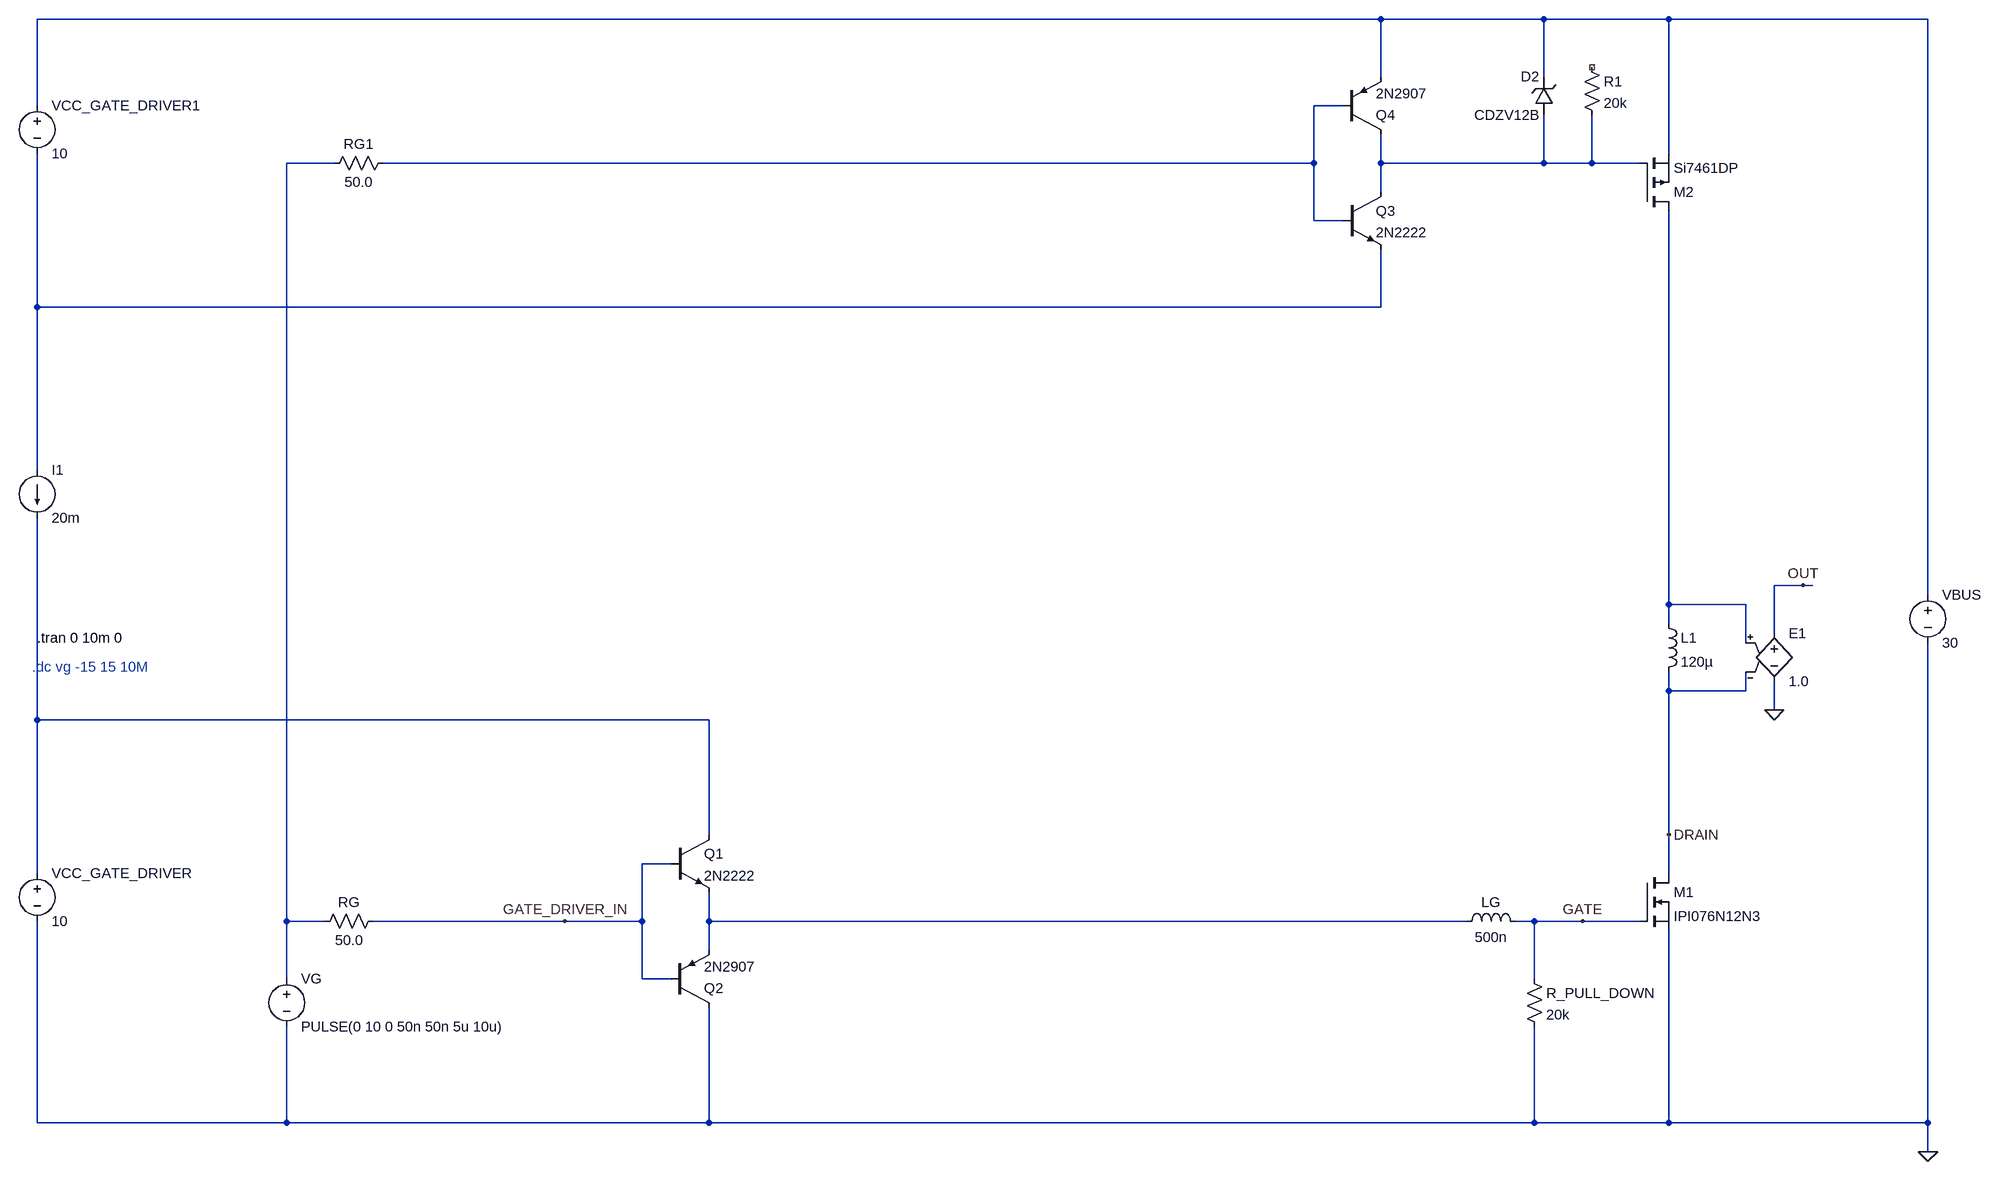
[diagram p0: schematic Hi_Lo_Gate_Driver.asc]
Hi_Lo_Gate_Driver.asc, the LTspice schematic file:
Version 4.1
SHEET 1 2380 948
WIRE 1376 -1248 -864 -1248
WIRE 1648 -1248 1376 -1248
WIRE 1856 -1248 1648 -1248
WIRE 2288 -1248 1856 -1248
WIRE 1376 -1152 1376 -1248
WIRE 1648 -1152 1648 -1248
WIRE -864 -1104 -864 -1248
WIRE 1312 -1104 1264 -1104
WIRE 1856 -1024 1856 -1248
WIRE -368 -1008 -448 -1008
WIRE 1264 -1008 1264 -1104
WIRE 1264 -1008 -288 -1008
WIRE 1376 -1008 1376 -1056
WIRE 1648 -1008 1648 -1088
WIRE 1648 -1008 1376 -1008
WIRE 1728 -1008 1728 -1088
WIRE 1728 -1008 1648 -1008
WIRE 1808 -1008 1728 -1008
WIRE 1376 -960 1376 -1008
WIRE 1264 -912 1264 -1008
WIRE 1312 -912 1264 -912
WIRE -864 -768 -864 -1024
WIRE 1376 -768 1376 -864
WIRE 1376 -768 -864 -768
WIRE -864 -496 -864 -768
WIRE 2080 -304 2032 -304
WIRE 2096 -304 2080 -304
WIRE 2288 -288 2288 -1248
WIRE 1856 -272 1856 -928
WIRE 1984 -272 1856 -272
WIRE 1856 -240 1856 -272
WIRE 2032 -224 2032 -304
WIRE 1984 -208 1984 -272
WIRE 1856 -128 1856 -160
WIRE 1984 -128 1984 -160
WIRE 1984 -128 1856 -128
WIRE 2032 -96 2032 -144
WIRE -864 -80 -864 -416
WIRE 256 -80 -864 -80
WIRE 256 112 256 -80
WIRE 1856 112 1856 -128
WIRE 192 160 144 160
WIRE -864 176 -864 -80
WIRE 1856 176 1856 112
WIRE -448 256 -448 -1008
WIRE -384 256 -448 256
WIRE 16 256 -304 256
WIRE 144 256 144 160
WIRE 144 256 16 256
WIRE 256 256 256 208
WIRE 1520 256 256 256
WIRE 1632 256 1600 256
WIRE 1712 256 1632 256
WIRE 1808 256 1712 256
WIRE 256 304 256 256
WIRE -448 352 -448 256
WIRE 144 352 144 256
WIRE 192 352 144 352
WIRE 1632 352 1632 256
WIRE -864 592 -864 256
WIRE -448 592 -448 432
WIRE -448 592 -864 592
WIRE 256 592 256 400
WIRE 256 592 -448 592
WIRE 1632 592 1632 432
WIRE 1632 592 256 592
WIRE 1856 592 1856 272
WIRE 1856 592 1632 592
WIRE 2288 592 2288 -208
WIRE 2288 592 1856 592
WIRE 2288 640 2288 592
FLAG 2288 640 0
FLAG 1712 256 GATE
FLAG 1856 112 DRAIN
FLAG 16 256 GATE_DRIVER_IN
FLAG 2032 -96 0
FLAG 2080 -304 OUT
SYMBOL npn 192 112 R0
SYMATTR InstName Q1
SYMATTR Value 2N2222
SYMBOL pnp 192 400 M180
SYMATTR InstName Q2
SYMATTR Value 2N2907
SYMBOL nmos 1808 176 R0
SYMATTR InstName M1
SYMATTR Value IPI076N12N3
SYMBOL voltage 2288 -304 R0
WINDOW 123 0 0 Left 0
WINDOW 39 0 0 Left 0
SYMATTR InstName VBUS
SYMATTR Value 30
SYMBOL voltage -864 160 R0
WINDOW 123 0 0 Left 0
WINDOW 39 0 0 Left 0
SYMATTR InstName VCC_GATE_DRIVER
SYMATTR Value 10
SYMBOL voltage -448 336 R0
WINDOW 123 0 0 Left 0
WINDOW 39 0 0 Left 0
SYMATTR InstName VG
SYMATTR Value PULSE(0 10 0 50n 50n 5u 10u)
SYMBOL res -400 272 R270
WINDOW 0 32 56 VTop 2
WINDOW 3 0 56 VBottom 2
SYMATTR InstName RG
SYMATTR Value 50.0
SYMBOL ind 1504 272 R270
WINDOW 0 32 56 VTop 2
WINDOW 3 5 56 VBottom 2
SYMATTR InstName LG
SYMATTR Value 500n
SYMATTR SpiceLine Rser=1m
SYMBOL res 1616 336 R0
SYMATTR InstName R_PULL_DOWN
SYMATTR Value 20k
SYMBOL pmos 1808 -928 M180
SYMATTR InstName M2
SYMATTR Value Si7461DP
SYMBOL res 1712 -1184 R0
SYMATTR InstName R1
SYMATTR Value 20k
SYMBOL zener 1664 -1088 R180
WINDOW 0 24 64 Left 2
WINDOW 3 24 0 Left 2
SYMATTR InstName D2
SYMATTR Value CDZV12B
SYMBOL e 2032 -240 R0
SYMATTR InstName E1
SYMATTR Value 1.0
SYMBOL ind 1840 -256 R0
SYMATTR InstName L1
SYMATTR Value 120µ
SYMATTR SpiceLine Rser=1m
SYMBOL npn 1312 -960 R0
SYMATTR InstName Q3
SYMATTR Value 2N2222
SYMBOL pnp 1312 -1056 M180
SYMATTR InstName Q4
SYMATTR Value 2N2907
SYMBOL voltage -864 -1120 R0
WINDOW 123 0 0 Left 0
WINDOW 39 0 0 Left 0
SYMATTR InstName VCC_GATE_DRIVER1
SYMATTR Value 10
SYMBOL res -384 -992 R270
WINDOW 0 32 56 VTop 2
WINDOW 3 0 56 VBottom 2
SYMATTR InstName RG1
SYMATTR Value 50.0
SYMBOL current -864 -496 R0
WINDOW 123 0 0 Left 0
WINDOW 39 0 0 Left 0
SYMATTR InstName I1
SYMATTR Value 20m
TEXT -864 -216 Left 2 !.tran 0 10m 0
TEXT -872 -168 Left 2 ;.dc vg -15 15 10M

The netlist it stands for:
* Hi_Lo_Gate_Driver.asc
Q1 N007 GATE_DRIVER_IN N008 0 2N2222
Q2 0 GATE_DRIVER_IN N008 0 2N2907
M1 DRAIN GATE 0 0 IPI076N12N3
VBUS N001 0 30
VCC_GATE_DRIVER N007 0 10
VG N003 0 PULSE(0 10 0 50n 50n 5u 10u)
RG N003 GATE_DRIVER_IN 50.0
LG N008 GATE 500n Rser=1m
R_PULL_DOWN GATE 0 20k
M2 N006 N004 N001 N001 Si7461DP
R1 NC_01 N004 20k
D2 N004 N001 CDZV12B
E1 OUT 0 N006 DRAIN 1.0
L1 N006 DRAIN 120µ Rser=1m
Q3 N004 N002 N005 0 2N2222
Q4 N004 N002 N001 0 2N2907
VCC_GATE_DRIVER1 N001 N005 10
RG1 N003 N002 50.0
I1 N005 N007 20m
.model D D
.lib standard.dio
.model NPN NPN
.model PNP PNP
.lib standard.bjt
.model NMOS NMOS
.model PMOS PMOS
.lib standard.mos
.tran 0 10m 0
* .dc vg -15 15 10M
.backanno
.end